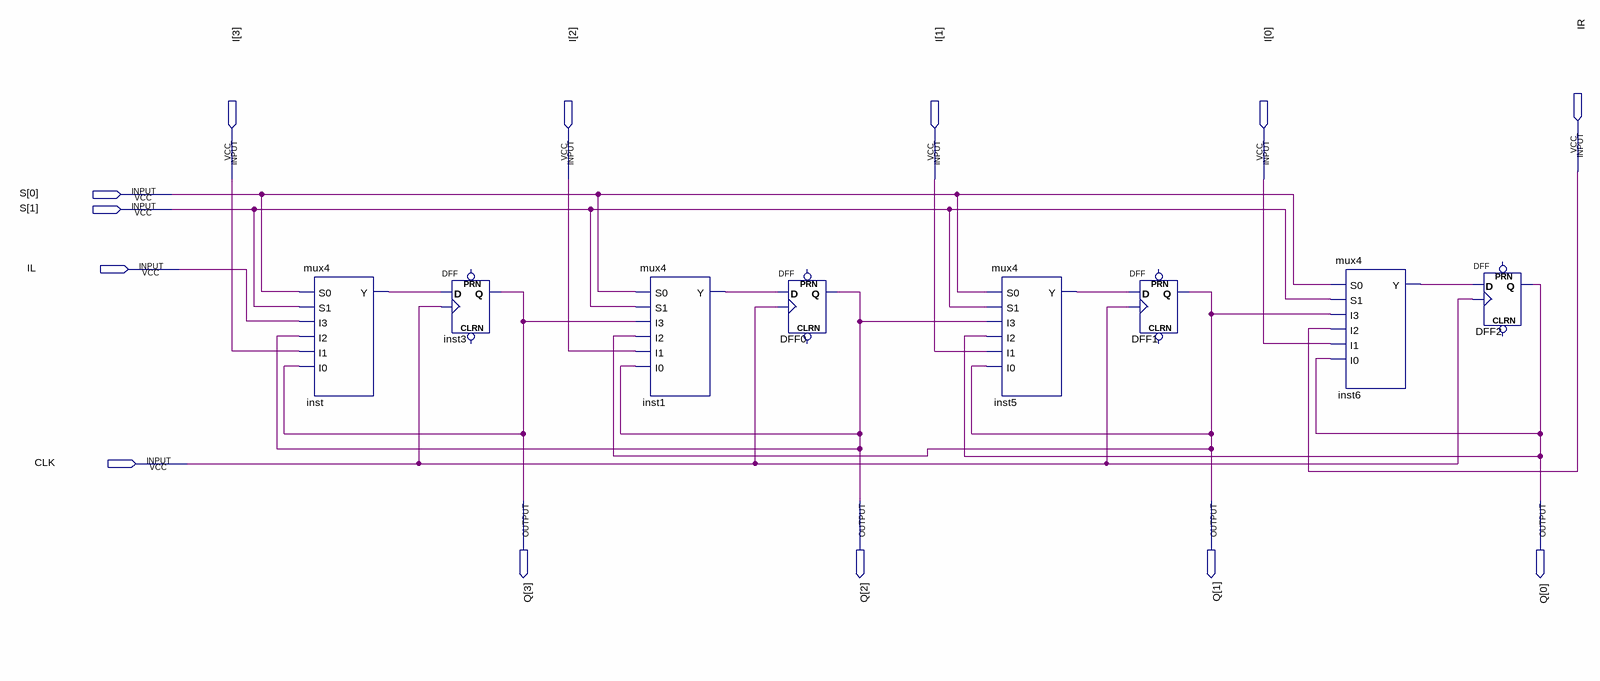
[diagram p0: schematic sheet]
// Quartus schematic shift_register_4bits.bdf as structural Verilog: 8 symbols, 13 pins
module shift_register_4bits (
  input  IR,
  input  [3:0] I,
  input  [1:0] S,
  input  IL,
  input  CLK,
  output [3:0] Q
);

  wire inst1_y, inst5_y, inst6_y, inst_y;

  mux4 inst (.S0(S[0]), .S1(S[1]), .I3(IL), .I2(Q[2]), .I1(I[3]), .I0(Q[3]), .Y(inst_y));
  DFF inst3 (.CLK(CLK), .D(inst_y), .Q(Q[3]));  // open: CLRN, PRN
  mux4 inst1 (.S0(S[0]), .S1(S[1]), .I3(Q[3]), .I2(Q[1]), .I1(I[2]), .I0(Q[2]), .Y(inst1_y));
  DFF DFF0 (.CLK(CLK), .D(inst1_y), .Q(Q[2]));  // open: CLRN, PRN
  mux4 inst5 (.S0(S[0]), .S1(S[1]), .I3(Q[2]), .I2(Q[0]), .I1(I[1]), .I0(Q[1]), .Y(inst5_y));
  DFF DFF1 (.CLK(CLK), .D(inst5_y), .Q(Q[1]));  // open: CLRN, PRN
  mux4 inst6 (.S0(S[0]), .S1(S[1]), .I3(Q[1]), .I2(IR), .I1(I[0]), .I0(Q[0]), .Y(inst6_y));
  DFF DFF2 (.CLK(CLK), .D(inst6_y), .Q(Q[0]));  // open: CLRN, PRN
endmodule
